# EAGLE design rgb_and_irdistance_side1 (EAGLE 6.5.0)
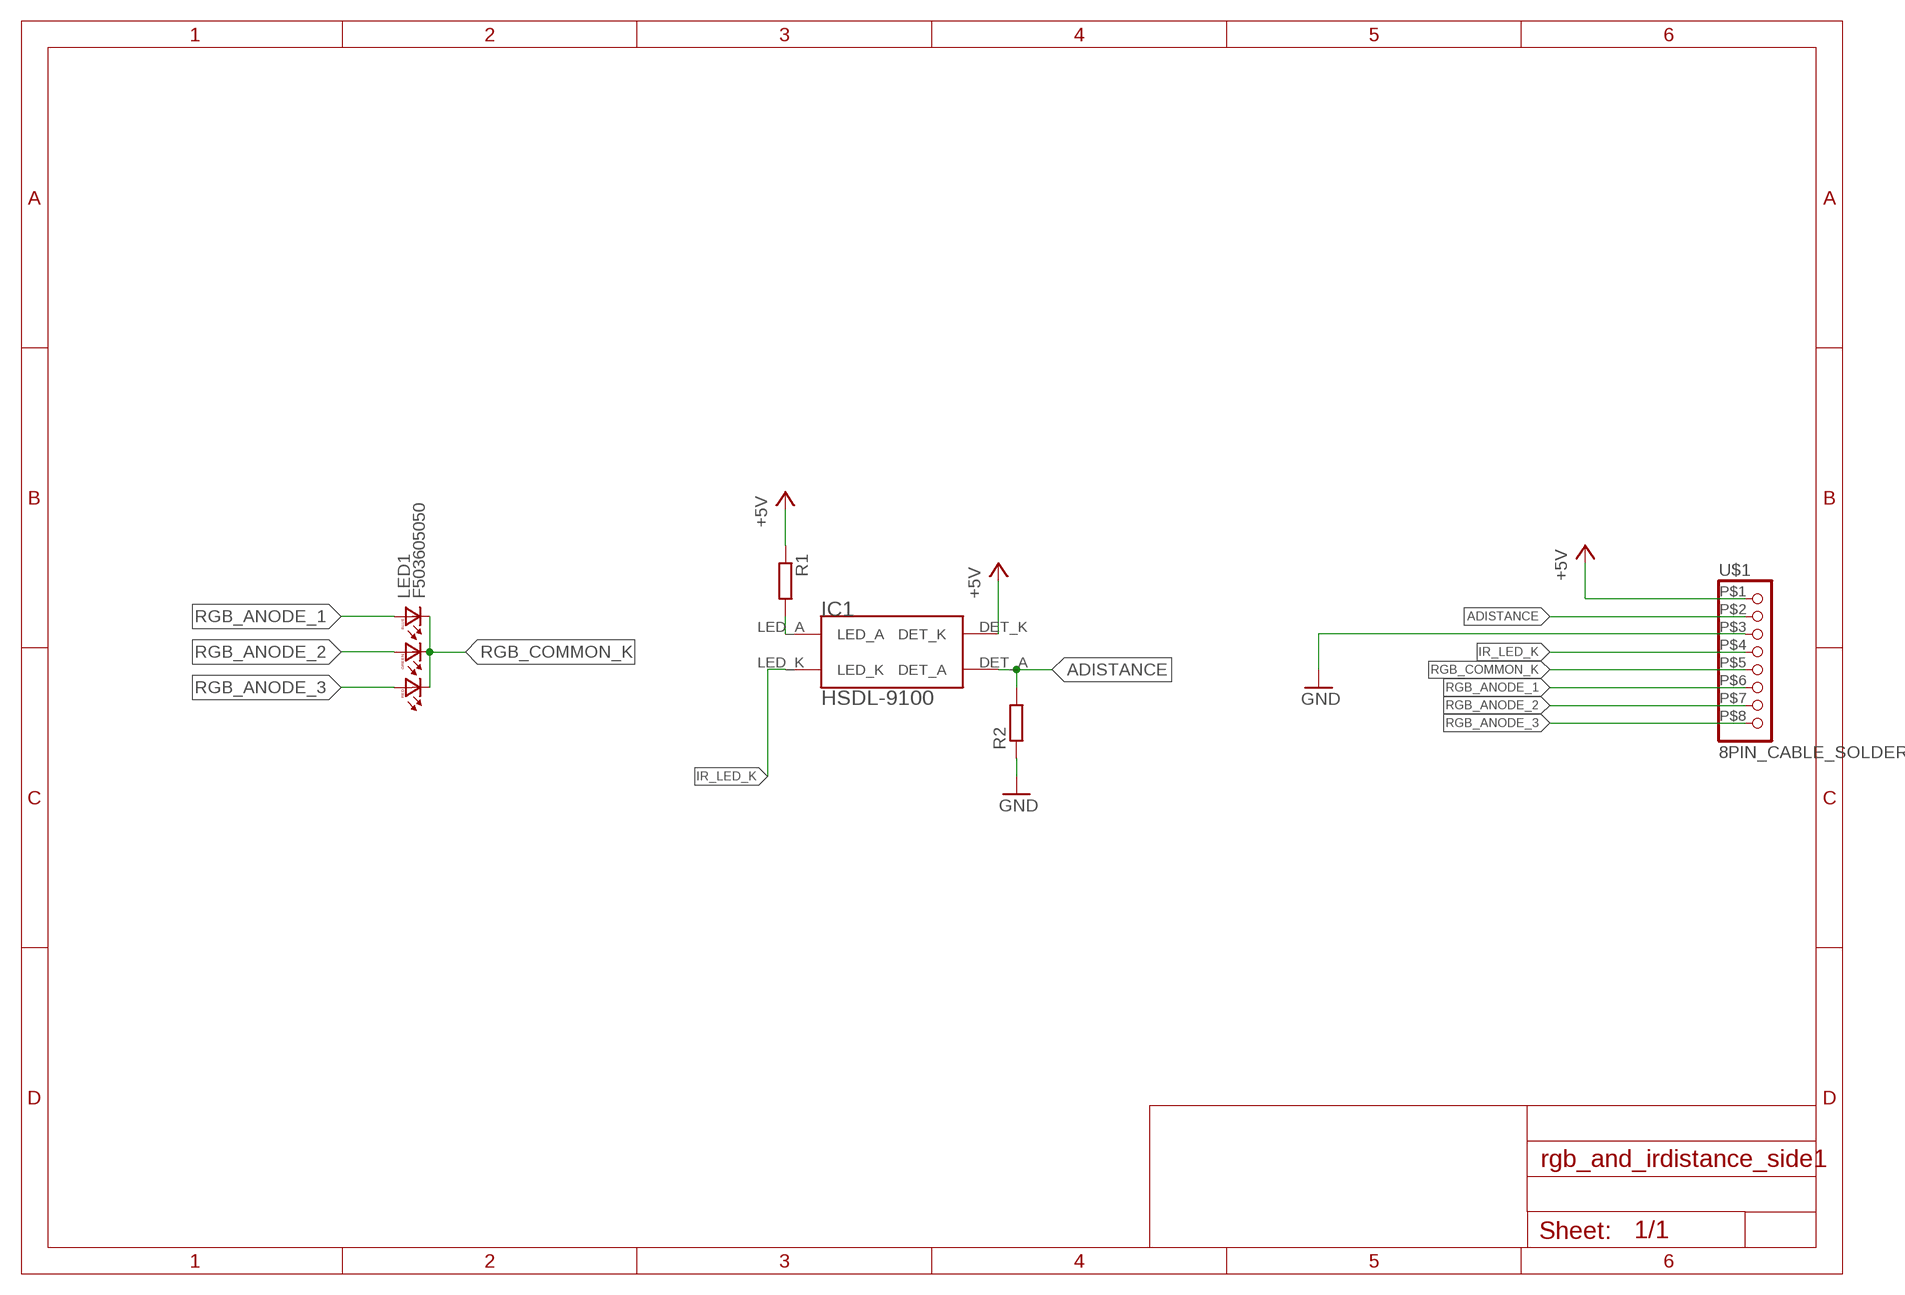
[diagram p0: schematic, sheet 1]

## Parts
IC1  HSDL-9100  [HSDL-9100]
LED1  F503605050  [5050LED]
R1  R-EU_M0805  [M0805]
R2  R-EU_M0805  [M0805]
U$1  8PIN_CABLE_SOLDER  [8PIN_CABLE_SOLDER]

## Nets
+5V: IC1.DET_K R1.1 U$1.P$1
ADISTANCE: IC1.DET_A R2.2 U$1.P$2
GND: R2.1 U$1.P$3
IR_LED_K: IC1.LED_K U$1.P$4
N$2: IC1.LED_A R1.2
RGB_ANODE_1: LED1.B1(BA) U$1.P$6
RGB_ANODE_2: LED1.G1(GA) U$1.P$7
RGB_ANODE_3: LED1.R1(RA) U$1.P$8
RGB_COMMON_K: LED1.B2(BC) LED1.G2(GC) LED1.R2(RC) U$1.P$5

## Library data of the parts
IC1 = BEEP:HSDL-9100
LED1 = BEEP:F50360: Full color Z-Power LED RGB P5-II Series Source: http://www.seoulsemicon.co.kr .. F50360.pdf
R1 R2 = resistor:R-EU_: RESISTOR, European symbol
U$1 = BEEP:8PIN_CABLE_SOLDER

## Board
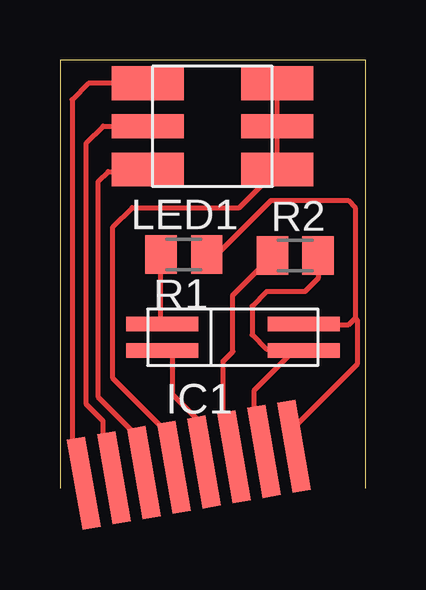
[diagram p1: board, top side]

Size 12.73 x 17.85 mm. Coordinates in mm from the lower left corner, seen from the top.
Outline: 12.73,0 12.73,17.85 0,17.85 0,0
Copper layers (1*16): Top 0.035mm / dielectric 1.5mm / Bottom 0.035mm
Design rules "default *": minimum track width 8mil, minimum drill 24mil, track to track 8mil, track to pad 8mil, pad to pad 8mil, via to via 8mil, smd to smd 8mil, copper to edge 0mil, drill to drill 8mil, minimum pad ring 10mil, minimum via ring 8mil, stop-mask expansion 4mil, vias tented up to drill 0mil, thermal gap 10mil

### Footprints (pad centres in the part's own frame; a part is rotated, then mirrored left to right if it is on the bottom)
HSDL-9100 = smd 3 x 0.6: DET_A 2.95,-0.55; DET_K 2.95,0.55; LED_A -2.95,0.55; LED_K -2.95,-0.55
5050LED = smd 3 x 1.4: B1 -2.7,-1.8; B2 2.7,-1.8; R1 -2.7,1.8; R2 2.7,1.8 | smd 3 x 1: G1 -2.7,0; G2 2.7,0
M0805 = smd 1.3 x 1.6: 1 -0.95,0; 2 0.95,0
8PIN_CABLE_SOLDER = smd 0.762 x 3.81: P$1 -3.81,0; P$2 -2.54,0; P$3 -1.27,0; P$4 0,0; P$5 1.27,0; P$6 2.54,0; P$7 3.81,0; P$8 5.08,0

### Placement (x,y rotation side)
IC1  7.2,6.3 0 top
LED1  6.35,15.08 0 top
R1  5.16,9.75 180 top
R2  9.8,9.7 0 top
U$1  6,1.1 190 top

### Tracks (layer width: path | path; a pad name or v marks a point on that pad's centre or on a via)
+5V
  Top 0.203: U$1.P$1 9.75,2.55 12.4,5.2 12.4,7 12.3,7.1 | R1.1 6.55,9.75 8.8,12 12,12 12.3,11.7 12.3,7.1 | 12.3,7.1 12,6.8 10.5,6.8 IC1.DET_K
ADISTANCE
  Top 0.203: U$1.P$2 8.5,3 8.1,3.4 8.1,4.1 9.7,5.7 | 9.7,5.7 10.4,5.7 IC1.DET_A | R2.2 10.75,8.75 10.2,8.2 8.6,8.2 8,7.6 8,6.4 8.6,5.8 9.6,5.8 9.7,5.7
GND
  Top 0.203: U$1.P$3 7.25,2.65 6.8,3.1 6.8,5.3 7.2,5.7 7.2,8.05 R2.1
IR_LED_K
  Top 0.203: U$1.P$4 6,2.6 4.7,3.9 4.7,5.6 IC1.LED_K
N$2
  Top 0.203: IC1.LED_A 4.35,6.85 4.2,7 R1.2
RGB_ANODE_1
  Top 0.203: U$1.P$6 3.5,1.9 1.6,3.8 1.6,12.8 2,13.2 3.57,13.2 LED1.B1
RGB_ANODE_2
  Top 0.203: U$1.P$7 2.25,1.75 1.8,2.2 1.8,2.8 1.1,3.5 1.1,14.4 1.8,15.1 3.63,15.1 LED1.G1
RGB_ANODE_3
  Top 0.203: LED1.R1 1.18,16.88 0.5,16.2 0.5,1.7 0.9,1.3 0.9,0.31 U$1.P$8 1,-0.2 1,-0.61
RGB_COMMON_K
  Top 0.203: U$1.P$5 4.75,2.05 2.2,4.6 2.2,10.9 3,11.7 7.47,11.7 LED1.B2 LED1.G2 LED1.R2